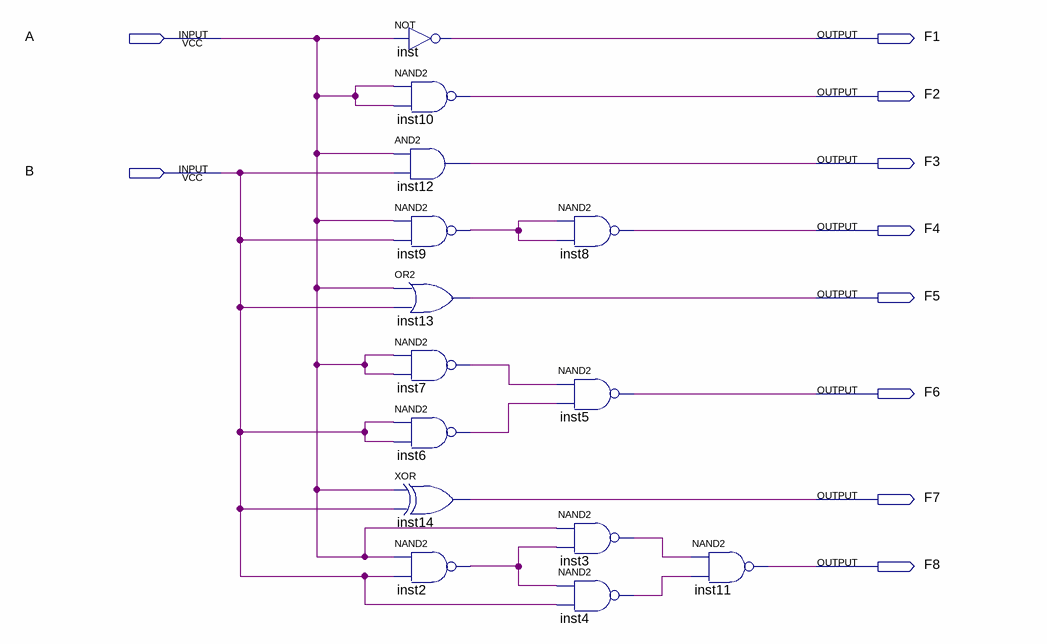
[diagram p0: schematic sheet]
// Quartus schematic 913031.bdf as structural Verilog: 14 symbols, 10 pins
module \913031  (
  input  A,
  input  B,
  output F1,
  output F2,
  output F3,
  output F4,
  output F5,
  output F6,
  output F7,
  output F8
);

  wire inst2_out, inst3_out, inst4_out, inst6_out, inst7_out, inst9_out;

  not inst (F1, A);
  nand inst10 (F2, A, A);
  and inst12 (F3, A, B);
  nand inst9 (inst9_out, A, B);
  or inst13 (F5, A, B);
  nand inst7 (inst7_out, A, A);
  nand inst6 (inst6_out, B, B);
  xor inst14 (F7, A, B);
  nand inst2 (inst2_out, A, B);
  nand inst8 (F4, inst9_out, inst9_out);
  nand inst5 (F6, inst7_out, inst6_out);
  nand inst3 (inst3_out, A, inst2_out);
  nand inst4 (inst4_out, inst2_out, B);
  nand inst11 (F8, inst3_out, inst4_out);
endmodule
